# Altium schematic sheet ip-mic.SchDoc
size A3
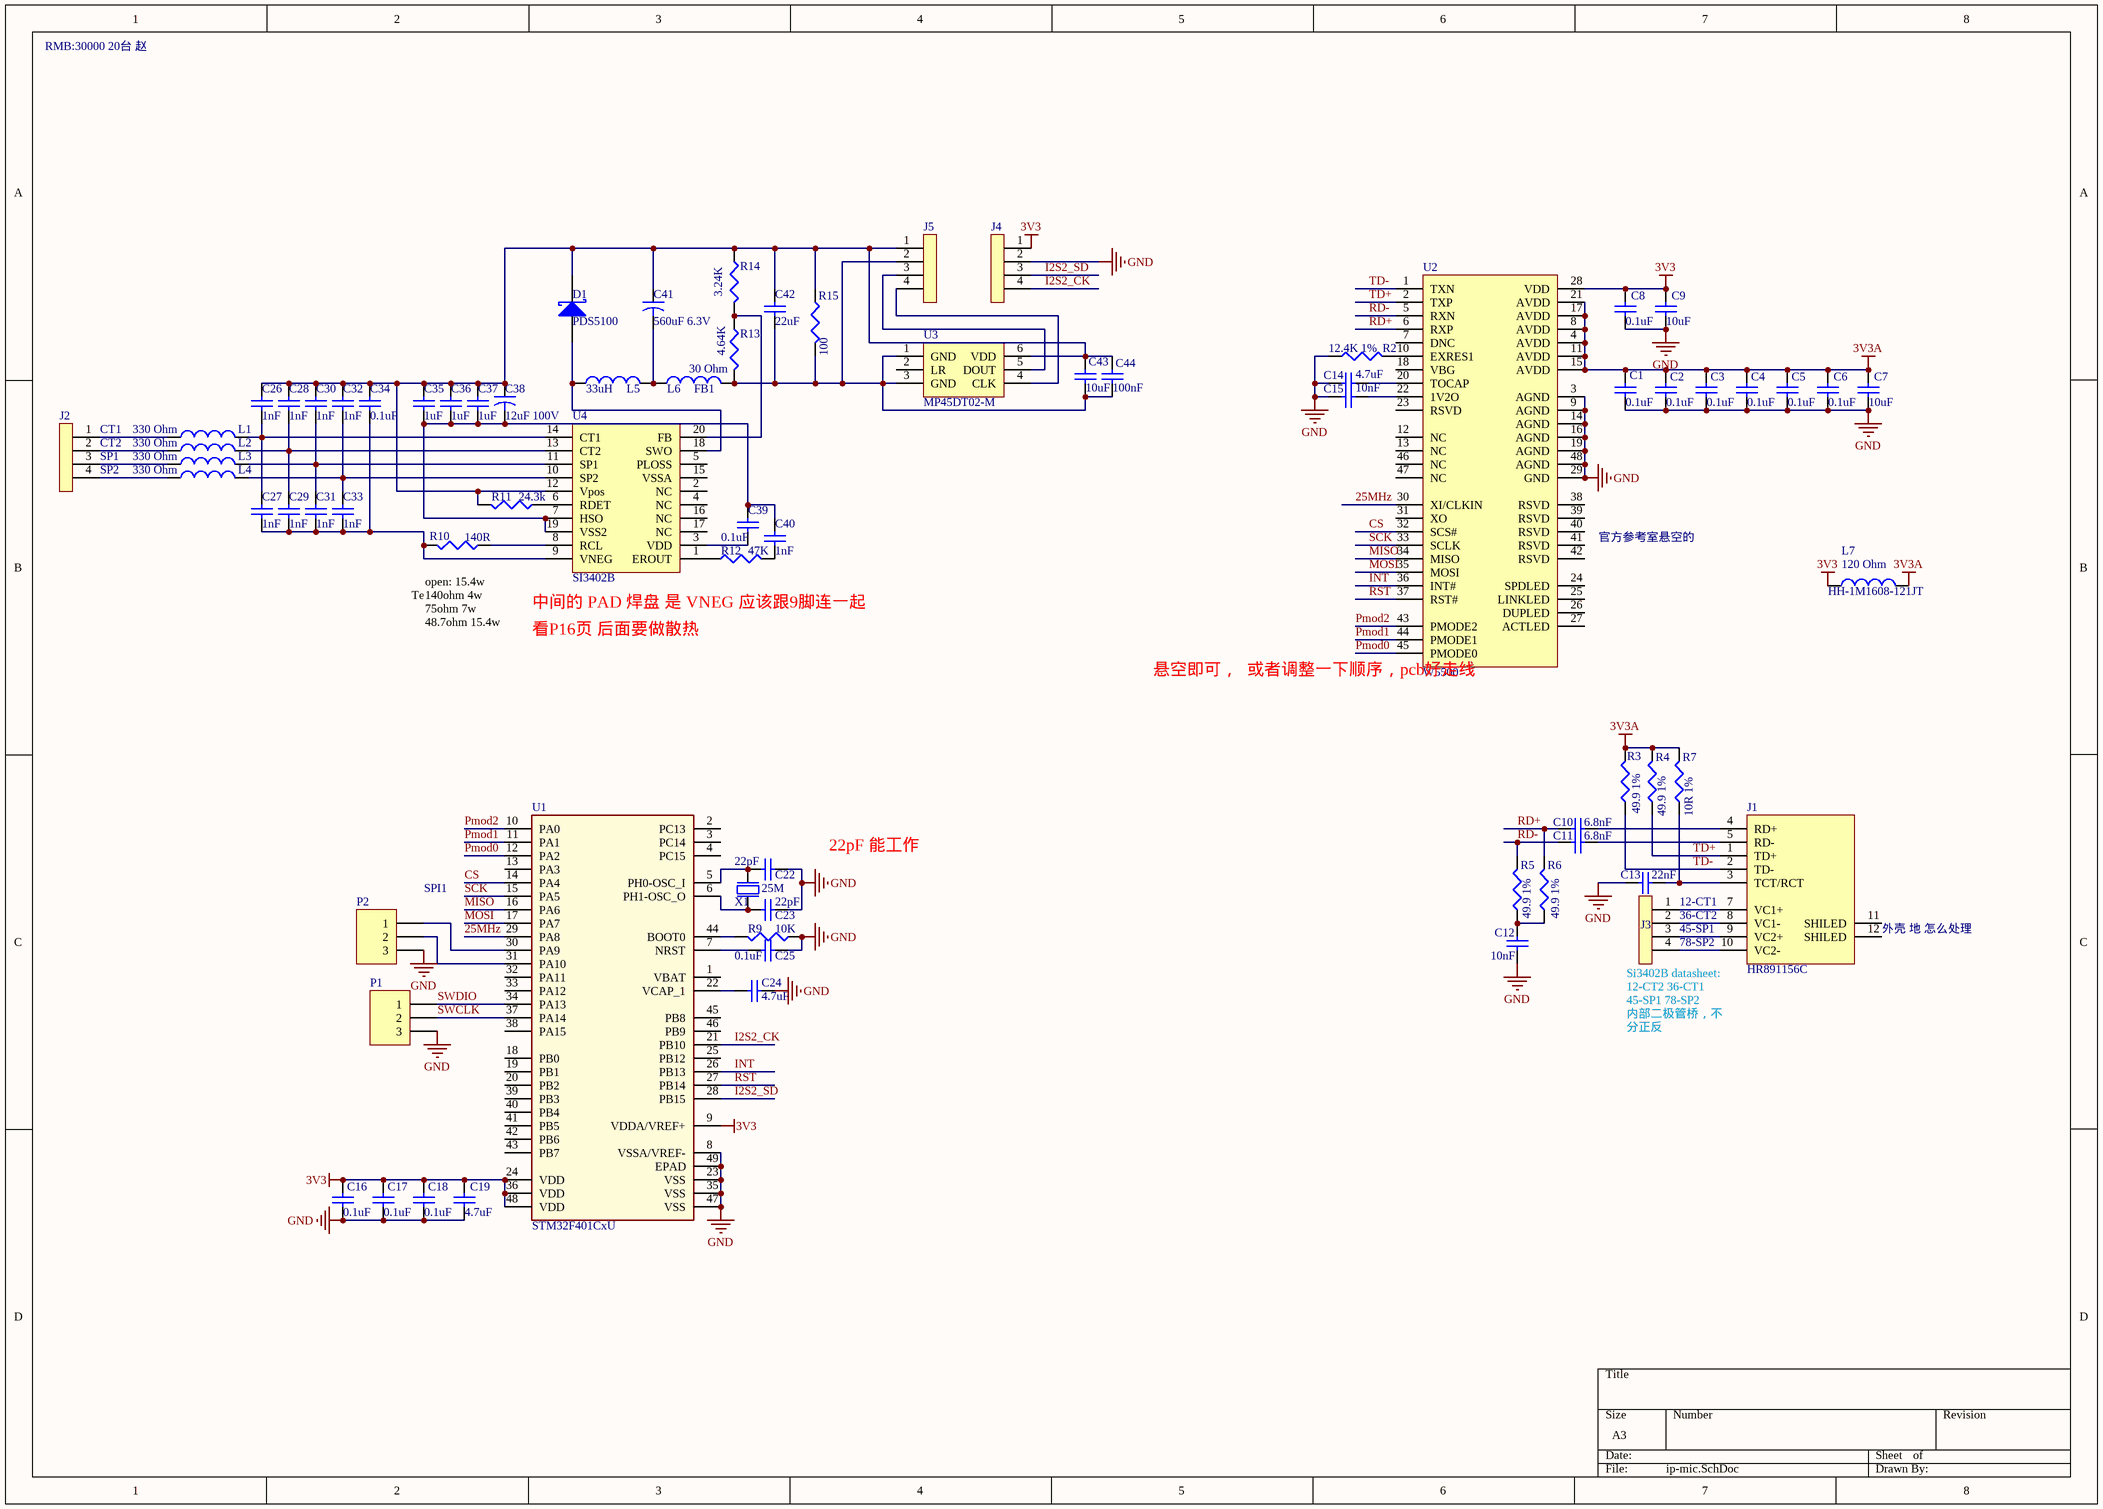
[diagram p0: ip-mic.SchDoc]

## Parts
C1  value 0.1uF  [0603_C]
C2  value 0.1uF  [0603_C]
C3  value 0.1uF  [0603_C]
C4  value 0.1uF  [0603_C]
C5  value 0.1uF  [0603_C]
C6  value 0.1uF  [0603_C]
C7  value 10uF  [0603_C]
C8  value 0.1uF  [C0603]
C9  value 10uF  [C0603]
C10  value 6.8nF  [0603_C]
C11  value 6.8nF  [0603_C]
C12  value 10nF  [0603_C]
C13  value 22nF  [0603_C]
C14  value 4.7uF  [0603_C]
C15  value 10nF  [0603_C]
C16  value 0.1uF  [C0603]
C17  value 0.1uF  [C0603]
C18  value 0.1uF  [C0603]
C19  value 4.7uF  [C0603]
C22  value 22pF  [C0603]
C23  value 22pF  [C0603]
C24  value 4.7uF  [C0603]
C25  value 0.1uF  [C0603]
C26  value 1nF  [C0603]
C27  value 1nF  [C0603]
C28  value 1nF  [C0603]
C29  value 1nF  [C0603]
C30  value 1nF  [C0603]
C31  value 1nF  [C0603]
C32  value 1nF  [C0603]
C33  value 1nF  [C0603]
C34  value 0.1uF  [C0805]
C35  value 1uF  [C1210]
C36  value 1uF  [C1210]
C37  value 1uF  [C1210]
C38  value 12uF 100V  [CAP1]
C39  value 0.1uF  [C0603]
C40  value 1nF  [C0603]
C41  value 560uF 6.3V  [CAP2]
C42  value 22uF  [C0805]
C43  value 10uF  [C0603]
C44  value 100nF  [C0603]
D1  PDS5100  [PDS5100]
J1  HR891156C  [HR891156C]
J2  (no value)  [CON4]
J3  (no value)  [CON4]
J4  (no value)  [CON4]
J5  (no value)  [CON4]
L1  value 330 Ohm  [L0805]
L2  value 330 Ohm  [L0805]
L3  value 330 Ohm  [L0805]
L4  value 330 Ohm  [L0805]
L5  value 33uH  [IND7x7]
L6  FB1  value 30 Ohm  [L0805]
L7  HH-1M1608-121JT  [L0805]
P1  (no value)  [CON3-SMT]
P2  (no value)  [CON3-SMT]
R2  value 12.4K 1%  [0603_R]
R3  value 49.9 1%  [0603_R]
R4  value 49.9 1%  [0603_R]
R5  value 49.9 1%  [0603_R]
R6  value 49.9 1%  [0603_R]
R7  value 10R 1%  [0603_R]
R9  value 10K  [C0603]
R10  value 140R  [R0603]
R11  value 24.3k  [R0603]
R12  value 47K  [R0603]
R13  value 4.64K  [R0603]
R14  value 3.24K  [R0603]
R15  value 100  [C0805]
U1  STM32F401CxU  [UFQFPN48-7X7]
U2  W5500  [LQFP48-7x7]
U3  MP45DT02-M  [MP45DT02-M-1]
U4  SI3402B  [SI3402B]
X1  25M  [XTAL3225]

## Nets
3V3: C8.2 C9.2 C16.2 C17.2 C18.2 C19.2 J4.1 L7.1 U1.9(VDDA/VREF+) U1.24(VDD) U1.36(VDD) U1.48(VDD) U2.28(VDD)
3V3A: C1.2 C2.2 C3.2 C4.2 C5.2 C6.2 C7.2 L7.2 R3.2 R4.2 R7.2 U2.4(AVDD) U2.8(AVDD) U2.11(AVDD) U2.15(AVDD) U2.17(AVDD) U2.21(AVDD)
GND: C1.1 C2.1 C3.1 C4.1 C5.1 C6.1 C7.1 C8.1 C9.1 C12.2 C13.1 C14.2 C15.2 C16.1 C17.1 C18.1 C19.1 C22.1 C23.1 C24.1 C25.1 J4.2 P1.3 P2.3 R2.1 R9.1 U1.8(VSSA/VREF-) U1.23(VSS) U1.35(VSS) U1.47(VSS) U1.49(EPAD) U2.3(AGND) U2.9(AGND) U2.14(AGND) U2.16(AGND) U2.19(AGND) U2.29(GND) U2.48(AGND) X1.2(GND) X1.4(GND)
25MHz: U1.29(PA8) U2.30(XI/CLKIN)
CS: U1.14(PA4) U2.32(SCS#)
I2S2_CK: J4.4 U1.21(PB10)
I2S2_SD: J4.3 U1.28(PB15)
INT: U1.26(PB13) U2.36(INT#)
MISO: U1.16(PA6) U2.34(MISO)
MOSI: U1.17(PA7) U2.35(MOSI)
Pmod0: U1.12(PA2) U2.45(PMODE0)
Pmod1: U1.11(PA1) U2.44(PMODE1)
Pmod2: U1.10(PA0) U2.43(PMODE2)
RD+: C10.2 R6.2 U2.6(RXP)
RD-: C11.2 R5.2 U2.5(RXN)
RST: U1.27(PB14) U2.37(RST#)
SCK: U1.15(PA5) U2.33(SCLK)
SWCLK: P1.2 U1.37(PA14)
SWDIO: P1.1 U1.34(PA13)
TD+: J1.1(TD+) R4.1 U2.2(TXP)
TD-: J1.2(TD-) R3.1 U2.1(TXN)
NetC10_1: C10.1 J1.4(RD+)
NetC11_1: C11.1 J1.5(RD-)
NetC12_1: C12.1 R5.1 R6.1
NetC13_2: C13.2 J1.3(TCT/RCT) R7.1
NetC14_1: C14.1 U2.20(TOCAP)
NetC15_1: C15.1 U2.22(1V2O)
NetC22_2: C22.2 U1.5(PH0-OSC_I) X1.3(out)
NetC23_2: C23.2 U1.6(PH1-OSC_O) X1.1(inp)
NetC24_2: C24.2 U1.22(VCAP_1)
NetC25_2: C25.2 U1.7(NRST)
NetC26_1: C26.1 C27.2 L1.2 U4.14(CT1)
NetC26_2: C26.2 C28.2 C30.2 C32.2 C34.2 C35.2 C36.2 C37.2 C38.1 C41.1 C42.2 C43.2 C44.2 D1.2(K) J5.1 R11.2 R14.1 R15.1 U3.6(VDD) U4.12(Vpos)
NetC27_1: C27.1 C29.1 C31.1 C33.1 C34.1 R10.2 U4.9(VNEG)
NetC28_1: C28.1 C29.2 L2.2 U4.13(CT2)
NetC30_1: C30.1 C31.2 L3.2 U4.11(SP1)
NetC32_1: C32.1 C33.2 L4.2 U4.10(SP2)
NetC35_1: C35.1 C36.1 C37.1 C38.2 C39.2 C40.2 U4.7(HSO) U4.19(VSS2)
NetC39_1: C39.1 U4.3(VDD)
NetC40_1: C40.1 R12.2
NetC41_2: C41.2 L5.2 L6.1
NetC42_1: C42.1 C43.1 C44.1 J5.2 L6.2 R13.2 R15.2 U3.1(GND) U3.3(GND)
NetD1_1: D1.1(A) L5.1 U4.18(SWO)
NetJ1_7: J1.7(VC1+) J3.1
NetJ1_8: J1.8(VC1-) J3.2
NetJ1_9: J1.9(VC2+) J3.3
NetJ1_10: J1.10(VC2-) J3.4
NetJ2_1: J2.1 L1.1
NetJ2_2: J2.2 L2.1
NetJ2_3: J2.3 L3.1
NetJ2_4: J2.4 L4.1
NetJ5_3: J5.3 U3.5(DOUT)
NetJ5_4: J5.4 U3.4(CLK)
NetP2_1: P2.1 U1.30(PA9)
NetP2_2: P2.2 U1.31(PA10)
NetR2_2: R2.2 U2.10(EXRES1)
NetR9_2: R9.2 U1.44(BOOT0)
NetR10_1: R10.1 U4.8(RCL)
NetR11_1: R11.1 U4.6(RDET)
NetR12_1: R12.1 U4.1(EROUT)
NetR13_1: R13.1 R14.2 U4.20(FB)

Not connected (* = marked no-connect by the designer): J1 11(SHILED) 12(SHILED); U1 1(VBAT) 2(PC13) 3(PC14) 4(PC15) 13(PA3) 18(PB0) 19(PB1) 20(PB2) 25(PB12) 32(PA11) 33(PA12) 38(PA15) 39(PB3) 40(PB4) 41(PB5) 42(PB6) 43(PB7) 45(PB8) 46(PB9); U2 7(DNC) 12(NC) 13(NC) 18(VBG) 23(RSVD) 24(SPDLED) 25(LINKLED) 26(DUPLED) 27(ACTLED) 31(XO) 38(RSVD) 39(RSVD) 40(RSVD) 41(RSVD) 42(RSVD) 46(NC) 47(NC); U3 2(LR); U4 2(NC) 4(NC) 5(PLOSS) 15(VSSA) 16(NC) 17(NC)

## Notes on the sheet
- RMB:30000 20台 赵
- (near J2) CT1
- (near J2) CT2
- (near J2) SP1
- (near J2) SP2
- (near U2) 官方参考室悬空的
- (near R10) Text
- (near R10) open: 15.4w
  140ohm 4w
  75ohm 7w
  48.7ohm 15.4w
- 中间的 PAD 焊盘 是 VNEG 应该跟9脚连一起
- 看P16页 后面要做散热
- 悬空即可，  或者调整一下顺序，pcb好走线
- 22pF 能工作
- (near P2) SPI1
- 12-CT1
- 36-CT2
- 45-SP1
- 78-SP2
- (near J1) 外壳 地 怎么处理
- Si3402B datasheet:
  12-CT2 36-CT1
  45-SP1 78-SP2
  内部二极管桥，不分正反
- (in symbol Ind) 120 Ohm

## Library data of the parts
C1-C19 C26-C37 C39 C40 C42-C44 = Cap: Published: 8-Jun-2000; LatestRevisionDate: 29-May-2009; LatestRevisionNote: IPC-7351 Footprint Added.; PackageReference: C1206; Publisher: Altium Limited; PackageDescription: Chip Capacitor
C22-C25 = Cap: Capacitor; Published: 8-Jun-2000; LatestRevisionDate: 17-Jul-2002; LatestRevisionNote: Re-released for DXP Platform.; PackageReference: RAD-0.3; Publisher: Altium Limited; PackageDescription: Radial Cap, Thru-Hole; 2 Leads; 0.3 in Pin Spacing
C38 C41 = Cap2: Capacitor; Published: 23-Sep-2002; PackageReference: CAPR5-4X5; Publisher: Altium Limited; PackageDescription: Capacitor; 2 Leads
D1 = D Schottky: Schottky Diode; Published: 8-Jun-2000; LatestRevisionDate: 17-Jul-2002; LatestRevisionNote: Re-released for DXP Platform.; PackageReference: SMB; Publisher: Altium Limited; PackageDescription: DO-214-AA/SMB; 2 C-Bend Leads; Body 5.3 x 3.6 mm, inc. leads (LxW); Code_JEDEC: DO-214-AA
J1 = HR891156C: with POE
J2-J5 = CON4
L1-L6 = Ind: Inductor; Code_IEC: 1005; Published: 8-Jun-2000; LatestRevisionDate: 29-May-2009; LatestRevisionNote: IPC-7351 Footprint Added.; PackageReference: 0402-A; Publisher: Altium Limited; PackageDescription: Chip Inductor; Code_JEITA: 0402
L7 = Ind: Code_IEC: 1005; Published: 8-Jun-2000; LatestRevisionDate: 29-May-2009; LatestRevisionNote: IPC-7351 Footprint Added.; PackageReference: 0402-A; Publisher: Altium Limited; PackageDescription: Chip Inductor; Code_JEITA: 0402
P1 P2 = Header 3: Header, 3-Pin; LatestRevisionDate: 17-Jul-2002; LatestRevisionNote: Re-released for DXP Platform.; Publisher: Altium Limited
R2-R7 R10-R15 = Res: Published: 8-Jun-2000; LatestRevisionDate: 29-May-2009; LatestRevisionNote: IPC-7351 Footprint Added.; PackageReference: J1-0603; Publisher: Altium Limited; PackageDescription: Chip Resistor
R9 = Res3: Resistor; Published: 8-Jun-2000; LatestRevisionDate: 29-May-2009; LatestRevisionNote: IPC-7351 Footprint Added.; PackageReference: J1-0603; Publisher: Altium Limited; PackageDescription: Chip Resistor
U1 = STM32F401CxU: CBU CCU CDU CEU 还适用 F412C F413C 来自 xls中 STM32F4xxC1
U3 = MP45DT02-M: digital microphone
U4 = SI3402B: PoE with DC-DC
X1 = XTAL_4pin: Part Number: NX2520SA-16MHZ-STD-CSW-5; Manufacturer: NDK; Value: 16MHz; Note: XTAL SMD 16.000MHz; Artikkelnr Noca: 22019192; Artikkelnr Simpro: N.A.; Manufacturer Part Number: NX2520SA-16MHZ-STD-CSW-5; Datasheet: http://www.ndk.com/images/products/catalog/c_NX2520SA-STD-CSW-5_e.pdf; LatestRevisionDate: 2012-06-15; Pin Count: 4; Publisher: Nordic Semiconductor; Published: 2012-06-15; Supplier: Digi-Key; Supplier part number: 644-1169-1-ND; 2nd source Supplier: *; 2nd source part number: *; Footprint Doc: BT-XTAL_2520